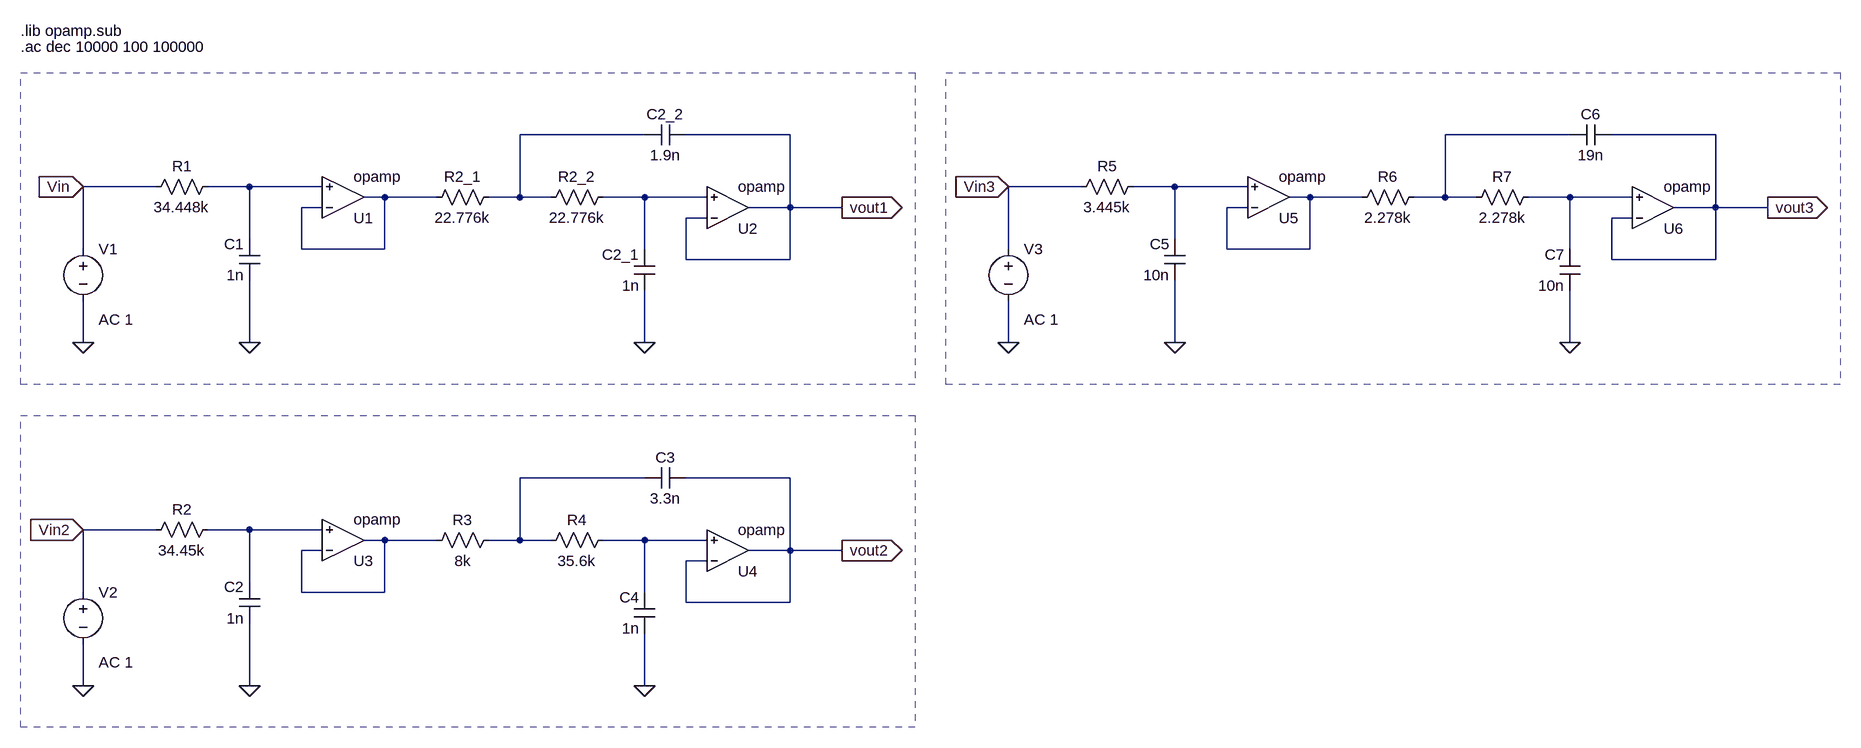
[diagram p0: schematic Bessel-Desnormalizado.asc]
Bessel-Desnormalizado.asc, the LTspice schematic file:
Version 4.1
SHEET 1 2604 772
WIRE 752 -144 560 -144
WIRE 976 -144 816 -144
WIRE 2176 -144 1984 -144
WIRE 2400 -144 2240 -144
WIRE 0 -64 -112 -64
WIRE 144 -64 80 -64
WIRE 256 -64 144 -64
WIRE 1424 -64 1312 -64
WIRE 1568 -64 1504 -64
WIRE 1680 -64 1568 -64
WIRE 352 -48 320 -48
WIRE 432 -48 352 -48
WIRE 560 -48 560 -144
WIRE 560 -48 512 -48
WIRE 608 -48 560 -48
WIRE 752 -48 688 -48
WIRE 848 -48 752 -48
WIRE 1776 -48 1744 -48
WIRE 1856 -48 1776 -48
WIRE 1984 -48 1984 -144
WIRE 1984 -48 1936 -48
WIRE 2032 -48 1984 -48
WIRE 2176 -48 2112 -48
WIRE 2272 -48 2176 -48
WIRE 256 -32 224 -32
WIRE 976 -32 976 -144
WIRE 976 -32 912 -32
WIRE 1056 -32 976 -32
WIRE 1680 -32 1648 -32
WIRE 2400 -32 2400 -144
WIRE 2400 -32 2336 -32
WIRE 2480 -32 2400 -32
WIRE 848 -16 816 -16
WIRE 2272 -16 2240 -16
WIRE 144 16 144 -64
WIRE 1568 16 1568 -64
WIRE -112 32 -112 -64
WIRE 224 32 224 -32
WIRE 352 32 352 -48
WIRE 352 32 224 32
WIRE 752 32 752 -48
WIRE 1312 32 1312 -64
WIRE 1648 32 1648 -32
WIRE 1776 32 1776 -48
WIRE 1776 32 1648 32
WIRE 2176 32 2176 -48
WIRE 816 48 816 -16
WIRE 976 48 976 -32
WIRE 976 48 816 48
WIRE 2240 48 2240 -16
WIRE 2400 48 2400 -32
WIRE 2400 48 2240 48
WIRE -112 176 -112 112
WIRE 144 176 144 80
WIRE 752 176 752 96
WIRE 1312 176 1312 112
WIRE 1568 176 1568 80
WIRE 2176 176 2176 96
WIRE 752 384 560 384
WIRE 976 384 816 384
WIRE 0 464 -112 464
WIRE 144 464 80 464
WIRE 256 464 144 464
WIRE 352 480 320 480
WIRE 432 480 352 480
WIRE 560 480 560 384
WIRE 560 480 512 480
WIRE 608 480 560 480
WIRE 752 480 688 480
WIRE 848 480 752 480
WIRE 256 496 224 496
WIRE 976 496 976 384
WIRE 976 496 912 496
WIRE 1056 496 976 496
WIRE 848 512 816 512
WIRE 144 544 144 464
WIRE -112 560 -112 464
WIRE 224 560 224 496
WIRE 352 560 352 480
WIRE 352 560 224 560
WIRE 752 560 752 480
WIRE 816 576 816 512
WIRE 976 576 976 496
WIRE 976 576 816 576
WIRE -112 704 -112 640
WIRE 144 704 144 608
WIRE 752 704 752 624
FLAG -112 176 0
FLAG 144 176 0
FLAG 1056 -32 vout1
IOPIN 1056 -32 Out
FLAG 752 176 0
FLAG -112 -64 Vin
IOPIN -112 -64 In
FLAG -112 704 0
FLAG 144 704 0
FLAG 1056 496 vout2
IOPIN 1056 496 Out
FLAG 752 704 0
FLAG -112 464 Vin2
IOPIN -112 464 In
FLAG 1312 176 0
FLAG 1568 176 0
FLAG 2480 -32 vout3
IOPIN 2480 -32 Out
FLAG 2176 176 0
FLAG 1312 -64 Vin3
IOPIN 1312 -64 In
SYMBOL voltage -112 16 R0
WINDOW 123 24 124 Left 2
WINDOW 39 0 0 Left 0
SYMATTR Value2 AC 1
SYMATTR InstName V1
SYMATTR Value ""
SYMBOL cap 160 80 R180
WINDOW 0 24 56 Left 2
WINDOW 3 24 8 Left 2
SYMATTR InstName C1
SYMATTR Value 1n
SYMBOL res 96 -80 R90
WINDOW 0 0 56 VBottom 2
WINDOW 3 32 56 VTop 2
SYMATTR InstName R1
SYMATTR Value 34.448k
SYMBOL OpAmps\\opamp 288 16 M180
SYMATTR InstName U1
SYMBOL res 528 -64 R90
WINDOW 0 0 56 VBottom 2
WINDOW 3 32 56 VTop 2
SYMATTR InstName R2_1
SYMATTR Value 22.776k
SYMBOL res 704 -64 R90
WINDOW 0 0 56 VBottom 2
WINDOW 3 32 56 VTop 2
SYMATTR InstName R2_2
SYMATTR Value 22.776k
SYMBOL cap 816 -160 R90
WINDOW 0 0 32 VBottom 2
WINDOW 3 32 32 VTop 2
SYMATTR InstName C2_2
SYMATTR Value 1.9n
SYMBOL cap 768 96 R180
WINDOW 0 24 56 Left 2
WINDOW 3 24 8 Left 2
SYMATTR InstName C2_1
SYMATTR Value 1n
SYMBOL OpAmps\\opamp 880 32 M180
SYMATTR InstName U2
SYMBOL voltage -112 544 R0
WINDOW 123 24 124 Left 2
WINDOW 39 0 0 Left 0
SYMATTR Value2 AC 1
SYMATTR InstName V2
SYMATTR Value ""
SYMBOL cap 160 608 R180
WINDOW 0 24 56 Left 2
WINDOW 3 24 8 Left 2
SYMATTR InstName C2
SYMATTR Value 1n
SYMBOL res 96 448 R90
WINDOW 0 0 56 VBottom 2
WINDOW 3 32 56 VTop 2
SYMATTR InstName R2
SYMATTR Value 34.45k
SYMBOL OpAmps\\opamp 288 544 M180
SYMATTR InstName U3
SYMBOL res 528 464 R90
WINDOW 0 0 56 VBottom 2
WINDOW 3 32 56 VTop 2
SYMATTR InstName R3
SYMATTR Value 8k
SYMBOL res 704 464 R90
WINDOW 0 0 56 VBottom 2
WINDOW 3 32 56 VTop 2
SYMATTR InstName R4
SYMATTR Value 35.6k
SYMBOL cap 816 368 R90
WINDOW 0 0 32 VBottom 2
WINDOW 3 32 32 VTop 2
SYMATTR InstName C3
SYMATTR Value 3.3n
SYMBOL cap 768 624 R180
WINDOW 0 24 56 Left 2
WINDOW 3 24 8 Left 2
SYMATTR InstName C4
SYMATTR Value 1n
SYMBOL OpAmps\\opamp 880 560 M180
SYMATTR InstName U4
SYMBOL voltage 1312 16 R0
WINDOW 123 24 124 Left 2
WINDOW 39 0 0 Left 0
SYMATTR Value2 AC 1
SYMATTR InstName V3
SYMATTR Value ""
SYMBOL cap 1584 80 R180
WINDOW 0 24 56 Left 2
WINDOW 3 24 8 Left 2
SYMATTR InstName C5
SYMATTR Value 10n
SYMBOL res 1520 -80 R90
WINDOW 0 0 56 VBottom 2
WINDOW 3 32 56 VTop 2
SYMATTR InstName R5
SYMATTR Value 3.445k
SYMBOL OpAmps\\opamp 1712 16 M180
SYMATTR InstName U5
SYMBOL res 1952 -64 R90
WINDOW 0 0 56 VBottom 2
WINDOW 3 32 56 VTop 2
SYMATTR InstName R6
SYMATTR Value 2.278k
SYMBOL res 2128 -64 R90
WINDOW 0 0 56 VBottom 2
WINDOW 3 32 56 VTop 2
SYMATTR InstName R7
SYMATTR Value 2.278k
SYMBOL cap 2240 -160 R90
WINDOW 0 0 32 VBottom 2
WINDOW 3 32 32 VTop 2
SYMATTR InstName C6
SYMATTR Value 19n
SYMBOL cap 2192 96 R180
WINDOW 0 24 56 Left 2
WINDOW 3 24 8 Left 2
SYMATTR InstName C7
SYMATTR Value 10n
SYMBOL OpAmps\\opamp 2304 32 M180
SYMATTR InstName U6
TEXT -208 -304 Left 2 !.lib opamp.sub
TEXT -208 -280 Left 2 !.ac dec 10000 100 100000
RECTANGLE Normal 1168 240 -208 -240 2
RECTANGLE Normal 1168 768 -208 288 2
RECTANGLE Normal 2592 240 1216 -240 2

The netlist it stands for:
* Bessel-Desnormalizado.asc
V1 Vin 0 AC 1
C1 0 N003 1n
R1 N003 Vin 34.448k
X§U1 N005 N003 N005 opamp Aol=100K GBW=10Meg  ; pins invin noninvin out
R2_1 N001 N005 22.776k
R2_2 N006 N001 22.776k
C2_2 vout1 N001 1.9n
C2_1 0 N006 1n
X§U2 vout1 N006 vout1 opamp Aol=100K GBW=10Meg  ; pins invin noninvin out
V2 Vin2 0 AC 1
C2 0 N010 1n
R2 N010 Vin2 34.45k
X§U3 N011 N010 N011 opamp Aol=100K GBW=10Meg  ; pins invin noninvin out
R3 N009 N011 8k
R4 N012 N009 35.6k
C3 vout2 N009 3.3n
C4 0 N012 1n
X§U4 vout2 N012 vout2 opamp Aol=100K GBW=10Meg  ; pins invin noninvin out
V3 Vin3 0 AC 1
C5 0 N004 10n
R5 N004 Vin3 3.445k
X§U5 N007 N004 N007 opamp Aol=100K GBW=10Meg  ; pins invin noninvin out
R6 N002 N007 2.278k
R7 N008 N002 2.278k
C6 vout3 N002 19n
C7 0 N008 10n
X§U6 vout3 N008 vout3 opamp Aol=100K GBW=10Meg  ; pins invin noninvin out
.lib opamp.sub
.ac dec 10000 100 100000
.backanno
.end